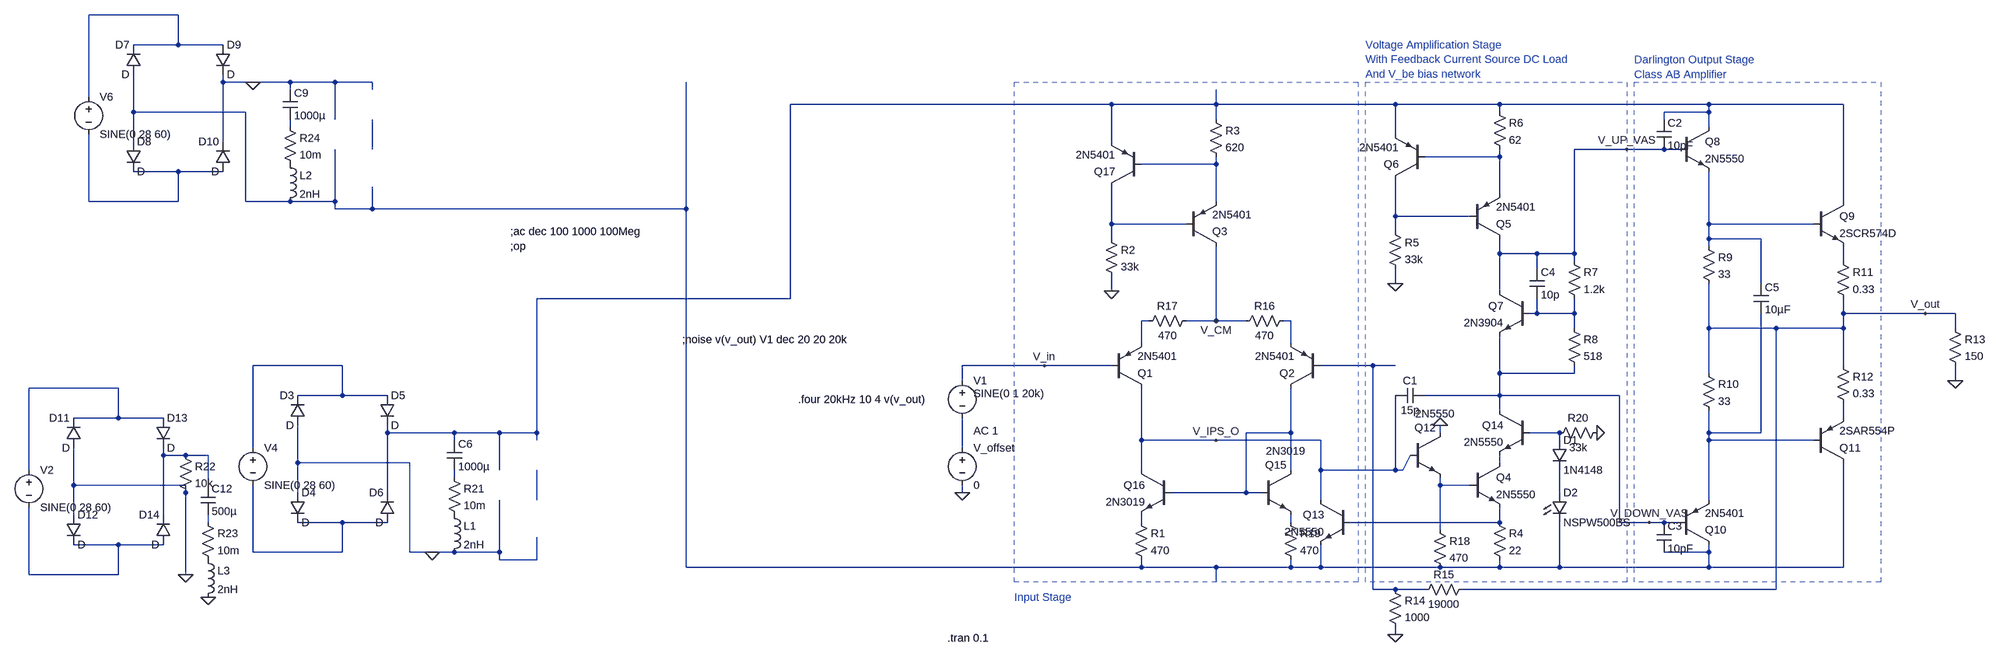
[diagram p0: schematic Final Design.asc]
Final Design.asc, the LTspice schematic file:
Version 4
SHEET 1 1848 888
WIRE -2032 -608 -2224 -608
WIRE -2032 -544 -2032 -608
WIRE -2032 -544 -2128 -544
WIRE -1936 -544 -2032 -544
WIRE -1936 -464 -1936 -480
WIRE -1872 -464 -1936 -464
WIRE -1792 -464 -1872 -464
WIRE -1696 -464 -1792 -464
WIRE -1616 -464 -1696 -464
WIRE -1792 -448 -1792 -464
WIRE -1616 -448 -1616 -464
WIRE -2224 -432 -2224 -608
WIRE -32 -416 -720 -416
WIRE 192 -416 192 -448
WIRE 192 -416 -32 -416
WIRE 576 -416 192 -416
WIRE 800 -416 576 -416
WIRE 1248 -416 800 -416
WIRE 1536 -416 1248 -416
WIRE -2128 -400 -2128 -480
WIRE -1888 -400 -2128 -400
WIRE 800 -400 800 -416
WIRE 1248 -400 1248 -416
WIRE 1248 -400 1152 -400
WIRE -1696 -384 -1696 -464
WIRE 192 -384 192 -416
WIRE 1152 -384 1152 -400
WIRE -1792 -368 -1792 -384
WIRE 1248 -368 1248 -400
WIRE 576 -352 576 -416
WIRE -2128 -336 -2128 -400
WIRE -1936 -336 -1936 -464
WIRE -32 -336 -32 -416
WIRE -1616 -320 -1616 -384
WIRE 1072 -320 960 -320
WIRE 1152 -320 1072 -320
WIRE 1184 -320 1152 -320
WIRE 800 -304 800 -320
WIRE 800 -304 640 -304
WIRE 192 -288 192 -304
WIRE 192 -288 32 -288
WIRE -2032 -272 -2128 -272
WIRE -1936 -272 -2032 -272
WIRE 800 -224 800 -304
WIRE -2224 -208 -2224 -352
WIRE -2032 -208 -2032 -272
WIRE -2032 -208 -2224 -208
WIRE -1888 -208 -1888 -400
WIRE -1792 -208 -1888 -208
WIRE -1696 -208 -1696 -320
WIRE -1696 -208 -1792 -208
WIRE 192 -208 192 -288
WIRE 1536 -208 1536 -416
WIRE -1696 -192 -1696 -208
WIRE -1616 -192 -1616 -240
WIRE -1616 -192 -1696 -192
WIRE -944 -192 -944 -464
WIRE -944 -192 -1616 -192
WIRE 576 -176 576 -256
WIRE 736 -176 576 -176
WIRE -32 -160 -32 -240
WIRE 128 -160 -32 -160
WIRE 1248 -160 1248 -272
WIRE 1472 -160 1248 -160
WIRE 576 -144 576 -176
WIRE -32 -128 -32 -160
WIRE 1248 -128 1248 -160
WIRE 1360 -128 1248 -128
WIRE 1248 -112 1248 -128
WIRE 800 -96 800 -128
WIRE 880 -96 800 -96
WIRE 960 -96 960 -320
WIRE 960 -96 880 -96
WIRE 960 -80 960 -96
WIRE 1536 -80 1536 -112
WIRE 880 -64 880 -96
WIRE 576 -32 576 -64
WIRE 1360 -32 1360 -128
WIRE -32 -16 -32 -48
WIRE 800 -16 800 -96
WIRE -720 0 -720 -416
WIRE -720 0 -1264 0
WIRE 880 32 880 0
WIRE 880 32 864 32
WIRE 960 32 960 0
WIRE 960 32 880 32
WIRE 1536 32 1536 0
WIRE 1712 32 1536 32
WIRE 1776 32 1712 32
WIRE 48 48 32 48
WIRE 192 48 192 -112
WIRE 192 48 128 48
WIRE 256 48 192 48
WIRE 352 48 336 48
WIRE 960 64 960 32
WIRE 1248 64 1248 -32
WIRE 1392 64 1248 64
WIRE 1536 64 1536 32
WIRE 1536 64 1392 64
WIRE 1776 64 1776 32
WIRE 32 96 32 48
WIRE 352 96 352 48
WIRE -1680 144 -1872 144
WIRE -176 144 -352 144
WIRE -32 144 -176 144
WIRE 528 144 416 144
WIRE 576 144 528 144
WIRE 1536 144 1536 64
WIRE 800 160 800 80
WIRE 960 160 960 144
WIRE 960 160 800 160
WIRE 1248 160 1248 64
WIRE -352 176 -352 144
WIRE 1776 176 1776 144
WIRE -2160 192 -2352 192
WIRE -1680 208 -1680 144
WIRE -1680 208 -1776 208
WIRE -1584 208 -1680 208
WIRE 800 208 800 160
WIRE 800 208 640 208
WIRE 1056 208 800 208
WIRE 800 240 800 208
WIRE -2160 256 -2160 192
WIRE -2160 256 -2256 256
WIRE -2064 256 -2160 256
WIRE 1536 256 1536 224
WIRE -1584 288 -1584 272
WIRE -1440 288 -1584 288
WIRE -1344 288 -1440 288
WIRE -1264 288 -1264 0
WIRE -1264 288 -1344 288
WIRE 352 288 352 192
WIRE 352 288 256 288
WIRE 672 288 672 272
WIRE 928 288 864 288
WIRE 1248 288 1248 240
WIRE 1360 288 1360 32
WIRE 1360 288 1248 288
WIRE -1440 304 -1440 288
WIRE -1264 304 -1264 288
WIRE 32 304 32 192
WIRE 192 304 32 304
WIRE 416 304 192 304
WIRE 928 304 928 288
WIRE 1248 304 1248 288
WIRE 1472 304 1248 304
WIRE -1872 320 -1872 144
WIRE -352 320 -352 256
WIRE -2064 336 -2064 320
WIRE -2016 336 -2064 336
WIRE -1968 336 -2016 336
WIRE -1776 352 -1776 272
WIRE -1536 352 -1776 352
WIRE 800 352 800 336
WIRE -2352 368 -2352 192
WIRE -1344 368 -1344 288
WIRE 32 368 32 304
WIRE 352 368 352 288
WIRE 416 368 416 304
WIRE 576 368 576 208
WIRE 576 368 416 368
WIRE 592 368 608 336
WIRE 592 368 576 368
WIRE -1440 384 -1440 368
WIRE -2256 400 -2256 320
WIRE -2016 400 -2256 400
WIRE -1968 400 -1968 336
WIRE 672 400 672 384
WIRE 736 400 672 400
WIRE -2016 416 -2016 400
WIRE -1776 416 -1776 352
WIRE -1584 416 -1584 288
WIRE -352 416 -352 400
WIRE 256 416 256 288
WIRE 256 416 96 416
WIRE 288 416 256 416
WIRE 928 416 928 368
WIRE -1264 432 -1264 368
WIRE 416 432 416 368
WIRE 1248 432 1248 304
WIRE -2256 464 -2256 400
WIRE -2064 464 -2064 336
WIRE -1968 480 -1968 464
WIRE -1680 480 -1776 480
WIRE -1584 480 -1680 480
WIRE 32 480 32 464
WIRE 352 480 352 464
WIRE 800 480 800 448
WIRE 800 480 480 480
WIRE 1056 480 1056 208
WIRE 1120 480 1056 480
WIRE 1152 480 1120 480
WIRE 1184 480 1152 480
WIRE 672 496 672 400
WIRE -2160 528 -2256 528
WIRE -2064 528 -2160 528
WIRE -1872 544 -1872 400
WIRE -1680 544 -1680 480
WIRE -1680 544 -1872 544
WIRE -1536 544 -1536 352
WIRE -1488 544 -1536 544
WIRE -1440 544 -1488 544
WIRE -1344 544 -1344 432
WIRE -1344 544 -1440 544
WIRE 1248 544 1248 528
WIRE 1248 544 1152 544
WIRE -1344 560 -1344 544
WIRE -1264 560 -1264 512
WIRE -1264 560 -1344 560
WIRE -944 576 -944 -192
WIRE 32 576 32 560
WIRE 32 576 -944 576
WIRE 192 576 32 576
WIRE 352 576 352 560
WIRE 352 576 192 576
WIRE 416 576 416 528
WIRE 416 576 352 576
WIRE 672 576 416 576
WIRE 800 576 800 560
WIRE 800 576 672 576
WIRE 928 576 928 480
WIRE 928 576 800 576
WIRE 1248 576 1248 544
WIRE 1248 576 928 576
WIRE 1536 576 1536 352
WIRE 1536 576 1248 576
WIRE -2352 592 -2352 448
WIRE -2160 592 -2160 528
WIRE -2160 592 -2352 592
WIRE -2016 592 -2016 416
WIRE 192 608 192 576
WIRE 528 624 528 144
WIRE 576 624 528 624
WIRE 640 624 576 624
WIRE 1392 624 1392 64
WIRE 1392 624 720 624
WIRE 576 720 576 704
FLAG -352 416 0
FLAG 576 -32 0
FLAG 1776 176 0
FLAG 576 720 0
FLAG 1712 32 V_out
FLAG -176 144 V_in
FLAG 192 48 V_CM
FLAG 192 304 V_IPS_O
FLAG 1072 -320 V_UP_VAS
FLAG 1120 480 V_DOWN_VAS
FLAG 672 272 0
FLAG 1008 288 0
FLAG -32 -16 0
FLAG -1872 -464 0
FLAG -1488 544 0
FLAG -2016 592 0
FLAG -1968 640 0
SYMBOL npn 736 352 R0
SYMATTR InstName Q4
SYMATTR Value 2N5550
SYMBOL res 784 464 R0
SYMATTR InstName R4
SYMATTR Value 22
SYMBOL cap 576 224 R270
WINDOW 0 32 32 VTop 2
WINDOW 3 0 32 VBottom 2
SYMATTR InstName C1
SYMATTR Value 15p
SYMBOL pnp 736 -128 M180
SYMATTR InstName Q5
SYMATTR Value 2N5401
SYMBOL pnp 640 -256 R180
SYMATTR InstName Q6
SYMATTR Value 2N5401
SYMBOL npn 864 -16 M0
SYMATTR InstName Q7
SYMATTR Value 2N3904
SYMBOL res 560 -160 R0
SYMATTR InstName R5
SYMATTR Value 33k
SYMBOL res 784 -416 R0
SYMATTR InstName R6
SYMATTR Value 62
SYMBOL res 944 -96 R0
SYMATTR InstName R7
SYMATTR Value 1.2k
SYMBOL res 944 48 R0
SYMATTR InstName R8
SYMATTR Value 518
SYMBOL res 1232 -128 R0
SYMATTR InstName R9
SYMATTR Value 33
SYMBOL res 1232 144 R0
SYMATTR InstName R10
SYMATTR Value 33
SYMBOL res 1520 -96 R0
SYMATTR InstName R11
SYMATTR Value 0.33
SYMBOL res 1520 128 R0
SYMATTR InstName R12
SYMATTR Value 0.33
SYMBOL res 1760 48 R0
SYMATTR InstName R13
SYMATTR Value 150
SYMBOL res 560 608 R0
SYMATTR InstName R14
SYMATTR Value 1000
SYMBOL res 736 608 R90
WINDOW 0 0 56 VBottom 2
WINDOW 3 32 56 VTop 2
SYMATTR InstName R15
SYMATTR Value 19000
SYMBOL pnp -32 192 M180
SYMATTR InstName Q1
SYMATTR Value 2N5401
SYMBOL pnp 416 192 R180
SYMATTR InstName Q2
SYMATTR Value 2N5401
SYMBOL npn 1184 -368 R0
SYMATTR InstName Q8
SYMATTR Value 2N5550
SYMBOL npn 1472 -208 R0
SYMATTR InstName Q9
SYMATTR Value 2SCR574D
SYMBOL pnp 1184 528 M180
SYMATTR InstName Q10
SYMATTR Value 2N5401
SYMBOL pnp 1472 352 M180
SYMATTR InstName Q11
SYMATTR Value 2SAR554P
SYMBOL voltage -352 304 R0
WINDOW 123 0 0 Left 2
WINDOW 39 0 0 Left 2
SYMATTR InstName V_offset
SYMATTR Value 0
SYMBOL voltage -352 160 R0
WINDOW 123 24 124 Left 2
WINDOW 39 0 0 Left 2
WINDOW 3 24 44 Left 2
SYMATTR Value2 AC 1
SYMATTR Value SINE(0 1 20k)
SYMATTR InstName V1
SYMBOL cap 1136 -384 R0
SYMATTR InstName C2
SYMATTR Value 10pF
SYMBOL cap 1136 480 R0
SYMATTR InstName C3
SYMATTR Value 10pF
SYMBOL res 352 32 R90
WINDOW 0 0 56 VBottom 2
WINDOW 3 32 56 VTop 2
SYMATTR InstName R16
SYMATTR Value 470
SYMBOL res 144 32 R90
WINDOW 0 0 56 VBottom 2
WINDOW 3 32 56 VTop 2
SYMATTR InstName R17
SYMATTR Value 470
SYMBOL npn 608 288 R0
WINDOW 0 9 -11 Left 2
WINDOW 3 11 -41 Left 2
SYMATTR InstName Q12
SYMATTR Value 2N5550
SYMBOL npn 480 432 M0
SYMATTR InstName Q13
SYMATTR Value 2N5550
SYMBOL res 656 480 R0
SYMATTR InstName R18
SYMATTR Value 470
SYMBOL npn 288 368 R0
WINDOW 0 9 -11 Left 2
WINDOW 3 11 -41 Left 2
SYMATTR InstName Q15
SYMATTR Value 2N3019
SYMBOL npn 96 368 M0
SYMATTR InstName Q16
SYMATTR Value 2N3019
SYMBOL res 16 464 R0
SYMATTR InstName R1
SYMATTR Value 470
SYMBOL res 336 464 R0
SYMATTR InstName R19
SYMATTR Value 470
SYMBOL npn 864 240 M0
SYMATTR InstName Q14
SYMATTR Value 2N5550
SYMBOL cap 864 -64 R0
SYMATTR InstName C4
SYMATTR Value 10p
SYMBOL diode 912 304 R0
SYMATTR InstName D1
SYMATTR Value 1N4148
SYMBOL LED 912 416 R0
SYMATTR InstName D2
SYMATTR Value NSPW500BS
SYMATTR Description Diode
SYMATTR Type diode
SYMBOL res 1024 272 R90
WINDOW 0 0 56 VBottom 2
WINDOW 3 32 56 VTop 2
SYMATTR InstName R20
SYMATTR Value 33k
SYMBOL pnp 128 -112 M180
SYMATTR InstName Q3
SYMATTR Value 2N5401
SYMBOL pnp 32 -240 R180
SYMATTR InstName Q17
SYMATTR Value 2N5401
SYMBOL res -48 -144 R0
SYMATTR InstName R2
SYMATTR Value 33k
SYMBOL res 176 -400 R0
SYMATTR InstName R3
SYMATTR Value 620
SYMBOL cap 1344 -32 R0
SYMATTR InstName C5
SYMATTR Value 10µF
SYMBOL voltage -1872 304 R0
WINDOW 123 0 0 Left 2
WINDOW 39 0 0 Left 2
SYMATTR InstName V4
SYMATTR Value SINE(0 28 60)
SYMBOL diode -1760 272 R180
WINDOW 0 24 64 Left 2
WINDOW 3 24 0 Left 2
SYMATTR InstName D3
SYMBOL diode -1792 416 R0
SYMATTR InstName D4
SYMBOL diode -1600 208 R0
SYMATTR InstName D5
SYMBOL diode -1568 480 R180
WINDOW 0 24 64 Left 2
WINDOW 3 24 0 Left 2
SYMATTR InstName D6
SYMBOL cap -1456 304 R0
SYMATTR InstName C6
SYMATTR Value 1000µ
SYMBOL res -1456 368 R0
SYMATTR InstName R21
SYMATTR Value 10m
SYMBOL ind -1456 448 R0
SYMATTR InstName L1
SYMATTR Value 2nH
SYMBOL voltage -2224 -448 R0
WINDOW 123 0 0 Left 2
WINDOW 39 0 0 Left 2
SYMATTR InstName V6
SYMATTR Value SINE(0 28 60)
SYMBOL diode -2112 -480 R180
WINDOW 0 24 64 Left 2
WINDOW 3 24 0 Left 2
SYMATTR InstName D7
SYMBOL diode -2144 -336 R0
SYMATTR InstName D8
SYMBOL diode -1952 -544 R0
SYMATTR InstName D9
SYMBOL diode -1920 -272 R180
WINDOW 0 24 64 Left 2
WINDOW 3 24 0 Left 2
SYMATTR InstName D10
SYMBOL cap -1808 -448 R0
SYMATTR InstName C9
SYMATTR Value 1000µ
SYMBOL res -1808 -384 R0
SYMATTR InstName R24
SYMATTR Value 10m
SYMBOL ind -1808 -304 R0
SYMATTR InstName L2
SYMATTR Value 2nH
SYMBOL voltage -2352 352 R0
WINDOW 123 0 0 Left 2
WINDOW 39 0 0 Left 2
SYMATTR InstName V2
SYMATTR Value SINE(0 28 60)
SYMBOL diode -2240 320 R180
WINDOW 0 24 64 Left 2
WINDOW 3 24 0 Left 2
SYMATTR InstName D11
SYMBOL diode -2272 464 R0
SYMATTR InstName D12
SYMBOL diode -2080 256 R0
SYMATTR InstName D13
SYMBOL diode -2048 528 R180
WINDOW 0 24 64 Left 2
WINDOW 3 24 0 Left 2
SYMATTR InstName D14
SYMBOL cap -1984 400 R0
SYMATTR InstName C12
SYMATTR Value 500µ
SYMBOL res -1984 464 R0
SYMATTR InstName R23
SYMATTR Value 10m
SYMBOL ind -1984 544 R0
SYMATTR InstName L3
SYMATTR Value 2nH
SYMBOL res -2032 320 R0
SYMATTR InstName R22
SYMATTR Value 10k
TEXT -384 728 Left 2 !.tran 0.1
TEXT -240 640 Left 2 ;Input Stage
TEXT -1320 -144 Left 2 !;ac dec 100 1000 100Meg
TEXT -1320 -112 Left 2 !;op
TEXT 512 -544 Left 2 ;Voltage Amplification Stage\nWith Feedback Current Source DC Load\nAnd V_be bias network
TEXT 1088 -512 Left 2 ;Darlington Output Stage\nClass AB Amplifier
TEXT -952 88 Left 2 !;noise v(v_out) V1 dec 20 20 20k
TEXT -704 216 Left 2 !.four 20kHz 10 4 v(v_out)
RECTANGLE Normal 496 608 -240 -464 2
RECTANGLE Normal 1072 608 512 -464 2
RECTANGLE Normal 1616 608 1088 -464 2

The netlist it stands for:
* Final Design.asc
Q4 N025 N027 N034 0 2N5550
R4 N034 N003 22
C1 V_IPS_O V_DOWN_VAS 15p
Q5 V_UP_VAS N009 N006 0 2N5401
Q6 N009 N006 N002 0 2N5401
Q7 V_UP_VAS N013 V_DOWN_VAS 0 2N3904
R5 N009 0 33k
R6 N002 N006 62
R7 V_UP_VAS N013 1.2k
R8 N013 V_DOWN_VAS 518
R9 N011 V_out 33
R10 V_out N022 33
R11 N012 V_out 0.33
R12 V_out N019 0.33
R13 V_out 0 150
R14 N017 0 1000
R15 V_out N017 19000
Q1 V_IPS_O V_in N014 0 2N5401
Q2 N020 N017 N015 0 2N5401
Q8 N002 V_UP_VAS N011 0 2N5550
Q9 N002 N011 N012 0 2SCR574D
Q10 N003 V_DOWN_VAS N022 0 2N5401
Q11 N003 N022 N019 0 2SAR554P
V_offset N023 0 0
V1 V_in N023 SINE(0 1 20k) AC 1
C2 N002 V_UP_VAS 10pF
C3 V_DOWN_VAS N003 10pF
R16 N015 V_CM 470
R17 V_CM N014 470
Q12 0 V_IPS_O N027 0 2N5550
Q13 V_IPS_O N034 N003 0 2N5550
R18 N027 N003 470
Q15 N020 N020 N033 0 2N3019
Q16 V_IPS_O N020 N032 0 2N3019
R1 N032 N003 470
R19 N033 N003 470
Q14 V_DOWN_VAS N021 N025 0 2N5550
C4 V_UP_VAS N013 10p
D1 N021 N028 1N4148
D2 N028 N003 NSPW500BS
R20 0 N021 33k
Q3 V_CM N010 N007 0 2N5401
Q17 N010 N007 N002 0 2N5401
R2 N010 0 33k
R3 N002 N007 620
C5 N011 N022 10µF
V4 N016 N031 SINE(0 28 60)
D3 0 N016 D
D4 0 N031 D
D5 N016 N002 D
D6 N031 N002 D
C6 N002 N026 1000µ
R21 N026 P001 10m
L1 P001 0 2nH
V6 N001 N008 SINE(0 28 60)
D7 N003 N001 D
D8 N003 N008 D
D9 N001 0 D
D10 N008 0 D
C9 0 N004 1000µ
R24 N004 P002 10m
L2 P002 N003 2nH
V2 N018 N035 SINE(0 28 60)
D11 0 N018 D
D12 0 N035 D
D13 N018 N024 D
D14 N035 N024 D
C12 N024 N030 500µ
R23 N030 P003 10m
L3 P003 0 2nH
R22 N024 0 10k
.model D D
.lib standard.dio
.model NPN NPN
.model PNP PNP
.lib standard.bjt
.tran 0.1
* Input Stage
;ac dec 100 1000 100Meg
;op
* Voltage Amplification Stage
* With Feedback Current Source DC Load
* And V_be bias network
* Darlington Output Stage
* Class AB Amplifier
;noise v(v_out) V1 dec 20 20 20k
.four 20kHz 10 4 v(v_out)
.backanno
.end